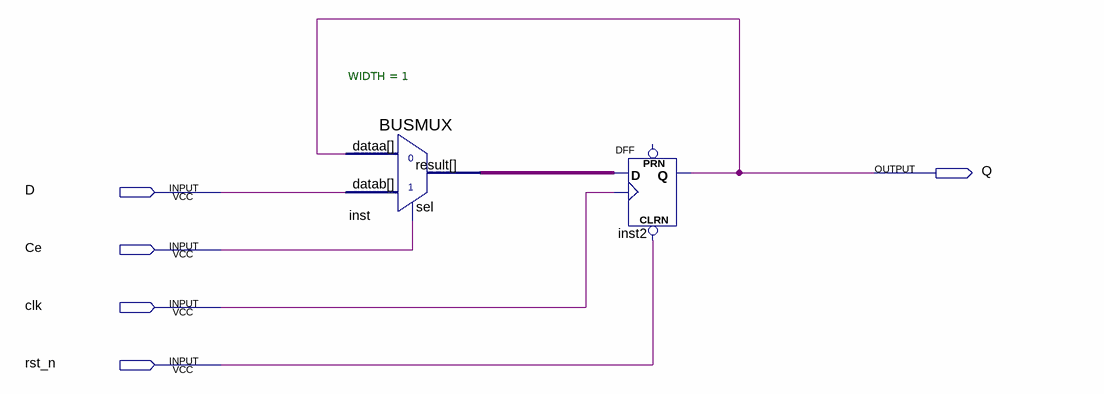
[diagram p0: schematic sheet]
// Quartus schematic Register1.bdf as structural Verilog: 2 symbols, 5 pins
module Register1 (
  input  D,
  input  Ce,
  input  clk,
  input  rst_n,
  output Q
);

  wire inst_result;

  BUSMUX #(.WIDTH(1)) inst (.datab(D), .sel(Ce), .dataa(Q), .result(inst_result));
  DFF inst2 (.CLRN(rst_n), .CLK(clk), .D(inst_result), .Q(Q));  // open: PRN
endmodule
